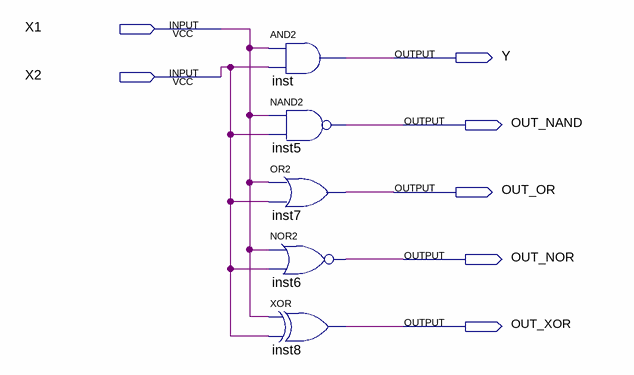
[diagram p0: schematic sheet]
// Quartus schematic labar1.bdf as structural Verilog: 5 symbols, 7 pins
module labar1 (
  input  X1,
  input  X2,
  output Y,
  output OUT_NAND,
  output OUT_OR,
  output OUT_NOR,
  output OUT_XOR
);

  and inst (Y, X1, X2);
  nand inst5 (OUT_NAND, X1, X2);
  or inst7 (OUT_OR, X1, X2);
  nor inst6 (OUT_NOR, X1, X2);
  xor inst8 (OUT_XOR, X1, X2);
endmodule
